# EAGLE design 8_digit_7_segment (EAGLE 9.2.0)

## Sheet 1 of 2
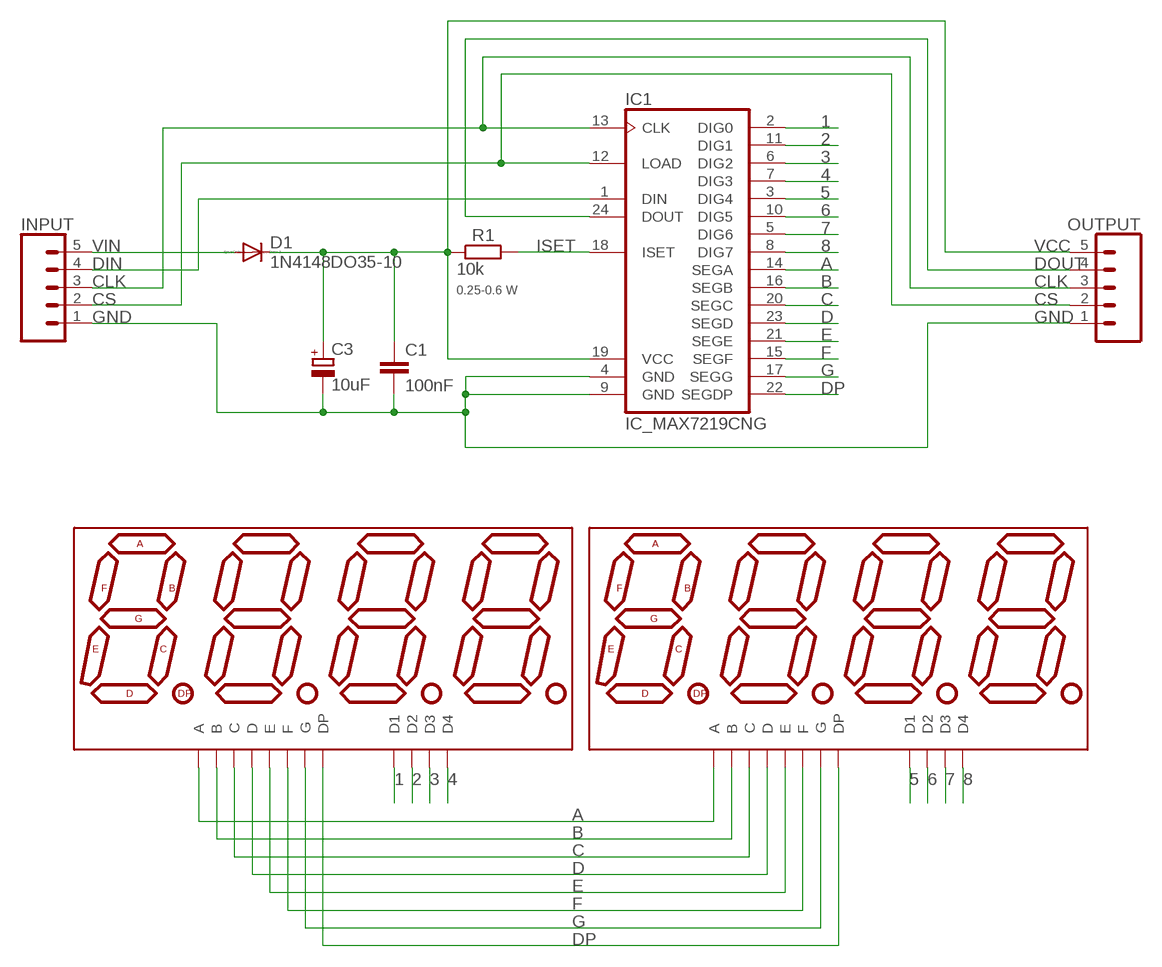
[diagram p0: schematic, sheet 1]

### Parts
C1  100nF  CAPACITOR_1025-024X044  [C025-024X044]
C3  10uF  CAPACITOR_POLARIZEDE2-5  [E2-5]
D1  1N4148DO35-10  DIODED-10  [D-10]
DISP5  ATA8041ARBJ  DISPLAY_7_SEGMENT_4DIGIT_20MM-RED  [7-SEGMENT-4DIGIT-20MM]
DISP6  ATA8041ARBJ  DISPLAY_7_SEGMENT_4DIGIT_20MM-RED  [7-SEGMENT-4DIGIT-20MM]
IC1  IC_MAX7219CNG  [DIL24-3]
INPUT  CONN_051X05LA  [1X05/90]
OUTPUT  CONN_051X05/90_FEMALE  [1X05/90FEMALE]
R1  10k  RESISTOR0207/7  [0207/7]

### Nets
1: DISP5.12(D1) IC1.2(DIG0)
2: DISP5.9(D2) IC1.11(DIG1)
3: DISP5.8(D3) IC1.6(DIG2)
4: DISP5.6(D4) IC1.7(DIG3)
5: DISP6.12(D1) IC1.3(DIG4)
6: DISP6.9(D2) IC1.10(DIG5)
7: DISP6.8(D3) IC1.5(DIG6)
8: DISP6.6(D4) IC1.8(DIG7)
A: DISP5.11(A) DISP6.11(A) IC1.14(SEGA)
B: DISP5.7(B) DISP6.7(B) IC1.16(SEGB)
C: DISP5.4(C) DISP6.4(C) IC1.20(SEGC)
CLK: IC1.13(CLK) INPUT.3 OUTPUT.3
CS: IC1.12(LOAD) INPUT.2 OUTPUT.2
D: DISP5.2(D) DISP6.2(D) IC1.23(SEGD)
DIN: IC1.1(DIN) INPUT.4
DOUT: IC1.24(DOUT) OUTPUT.4
DP: DISP5.3(DP) DISP6.3(DP) IC1.22(SEGDP)
E: DISP5.1(E) DISP6.1(E) IC1.21(SEGE)
F: DISP5.10(F) DISP6.10(F) IC1.15(SEGF)
G: DISP5.5(G) DISP6.5(G) IC1.17(SEGG)
GND: C1.2 C3.- IC1.4(GND) IC1.9(GND) INPUT.1 OUTPUT.1
ISET: IC1.18(ISET) R1.2
VCC: C1.1 C3.+ D1.C IC1.19(VCC) OUTPUT.5 R1.1
VIN: D1.A INPUT.5

## Sheet 2 of 2

## Library data of the parts
C1 = 006-rcl:CAPACITOR_1: CAPACITOR, European symbol; SPICEPREFIX: C
C3 = 006-rcl:CAPACITOR_POLARIZED: POLARIZED CAPACITOR, European symbol; SPICEPREFIX: C
D1 = 13-diode:DIODE: DIODE
DISP5 DISP6 = 001-private-inventory:DISPLAY_7_SEGMENT_4DIGIT_20MM: 4 Digit 7 Segment Display This is a part for the 4-Digit 7-segment LEDs from Young Sun. Different from the Digikey LEDs, all 16 pins are used. The LONGPADS Variant is used for a test jig, but you may like it because there is more pad to solder to. If you are concerned about routing space, the standard works just fine though. Datasheets: Red <http://cdn.sparkfun.com/datasheets/Components/LED/1LEDREDCC.pdf> Yellow <http://cdn.sparkfun.com/datasheets/Components/LED/1LEDYELCC.pdf> Green <http://cdn.sparkfun.com/datasheets/Components/LED/1LEDGRNCC.pdf> Blue <http://cdn.sparkfun.com/datasheets/Components/LED/1LEDBLUCC.pdf> White <http://cdn.sparkfun.com/datasheets/Components/LED/1LEDWHTCC.pdf> SparkFun Products Raw Components 7-Segment Display - 20mm (Red) <https://www.sparkfun.com/products/11405> (COM-11405) 7-Segment Display - 20mm (Yellow) <https://www.sparkfun.com/products/11406> (COM-11406) 7-Segment Display - 20mm (Green) <https://www.sparkfun.com/products/11407> (COM-11407) 7-Segment Display - 20mm (Blue) <https://www.sparkfun.com/products/11408> (COM-11408) 7-Segment Display - 20mm (White) <https://www.sparkfun.com/products/11409> (COM-11409) Serial Controlled SparkFun OpenSegment Serial Display - 20mm (Red) <https://www.sparkfun.com/products/11644> (COM-11644) SparkFun OpenSegment Serial Display - 20mm (Yellow) <https://www.sparkfun.com/products/11645> (COM-11645) SparkFun OpenSegment Serial Display - 20mm (Green) <https://www.sparkfun.com/products/11646> (COM-11646) SparkFun OpenSegment Serial Display - 20mm (Blue) <https://www.sparkfun.com/products/11647> (COM-11647) SparkFun OpenSegment Serial Display - 20mm (White) <https://www.sparkfun.com/products/11648> (COM-11648) Other SparkFun OpenSegment Shield <https://www.sparkfun.com/products/13190> (DEV-13190); PROD_ID: COMP-11449
IC1 = 14-displays:IC_MAX7219CNG: LED DISPLAY DRIVER; MF: MAXIM; MPN: MAX7219CNG; OC_FARNELL: 1523914; OC_NEWARK: 34C4018
INPUT = 001-private-inventory:CONN_05: Multi connection point. Often used as Generic Header-pin footprint for 0.1 inch spaced/style header connections On any of the 0.1 inch spaced packages, you can populate with these: Break Away Headers - Straight <https://www.sparkfun.com/products/116> (PRT-00116) Break Away Male Headers - Right Angle <https://www.sparkfun.com/products/553> (PRT-00553) Female Headers <https://www.sparkfun.com/products/115> (PRT-00115) Break Away Headers - Machine Pin <https://www.sparkfun.com/products/117> (PRT-00117) Break Away Female Headers - Swiss Machine Pin <https://www.sparkfun.com/products/743> (PRT-00743) For SCREWTERMINALS and SPRING TERMINALS visit here: Screw Terimnals on SparkFun.com <https://www.sparkfun.com/search/results?term=Screw+Terminals> (5mm/3.5mm/2.54mm spacing) This device is also useful as a general connection point to wire up your design to another part of your project. Our various solder wires solder well into these plated through hole pads. Hook-Up Wire - Assortment (Stranded, 22 AWG) <https://www.sparkfun.com/products/11375> (PRT-11375) Hook-Up Wire - Assortment (Solid Core, 22 AWG) <https://www.sparkfun.com/products/11367> (PRT-11367) View the entire wire category on our website here <https://www.sparkfun.com/categories/141> Special notes: Molex polarized connector foot print use with SKU : PRT-08231 with associated crimp pins and housings. 1MM SMD Version SKU: PRT-10208
OUTPUT = 007-connectors:CONN_05: Multi connection point. Often used as Generic Header-pin footprint for 0.1 inch spaced/style header connections On any of the 0.1 inch spaced packages, you can populate with these: Break Away Headers - Straight <https://www.sparkfun.com/products/116> (PRT-00116) Break Away Male Headers - Right Angle <https://www.sparkfun.com/products/553> (PRT-00553) Female Headers <https://www.sparkfun.com/products/115> (PRT-00115) Break Away Headers - Machine Pin <https://www.sparkfun.com/products/117> (PRT-00117) Break Away Female Headers - Swiss Machine Pin <https://www.sparkfun.com/products/743> (PRT-00743) For SCREWTERMINALS and SPRING TERMINALS visit here: Screw Terimnals on SparkFun.com <https://www.sparkfun.com/search/results?term=Screw+Terminals> (5mm/3.5mm/2.54mm spacing) This device is also useful as a general connection point to wire up your design to another part of your project. Our various solder wires solder well into these plated through hole pads. Hook-Up Wire - Assortment (Stranded, 22 AWG) <https://www.sparkfun.com/products/11375> (PRT-11375) Hook-Up Wire - Assortment (Solid Core, 22 AWG) <https://www.sparkfun.com/products/11367> (PRT-11367) View the entire wire category on our website here <https://www.sparkfun.com/categories/141> Special notes: Molex polarized connector foot print use with SKU : PRT-08231 with associated crimp pins and housings. 1MM SMD Version SKU: PRT-10208
R1 = 006-rcl:RESISTOR: RESISTOR, European symbol; POWER: 0.25-0.6 W; SPICEPREFIX: R

## Board
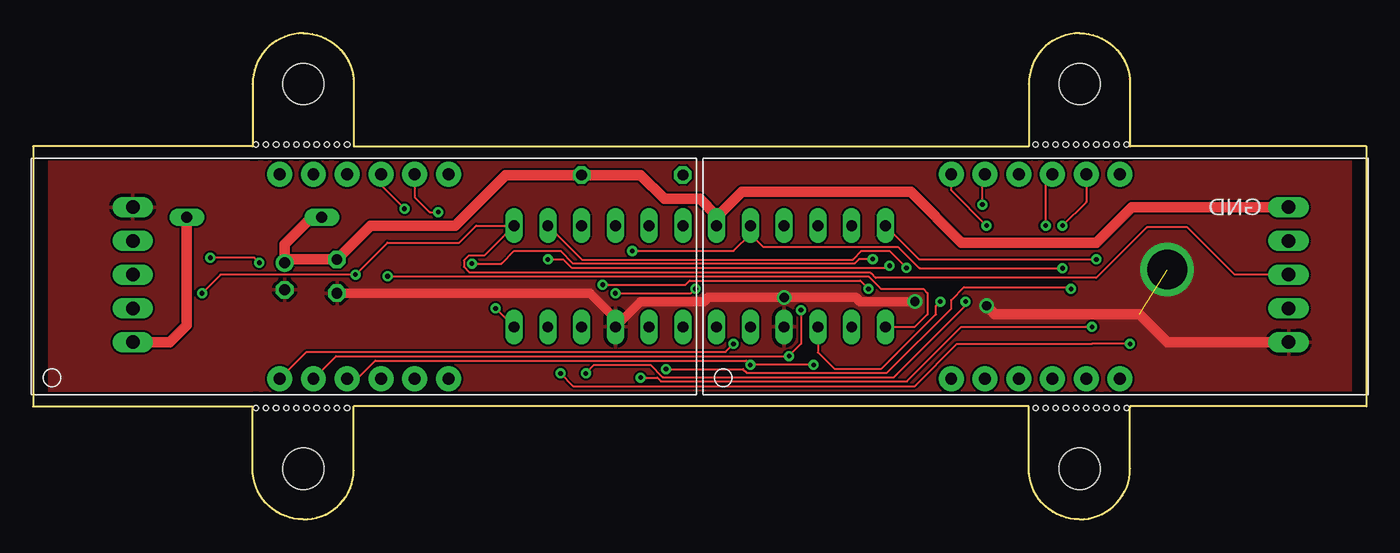
[diagram p1: board, top side]
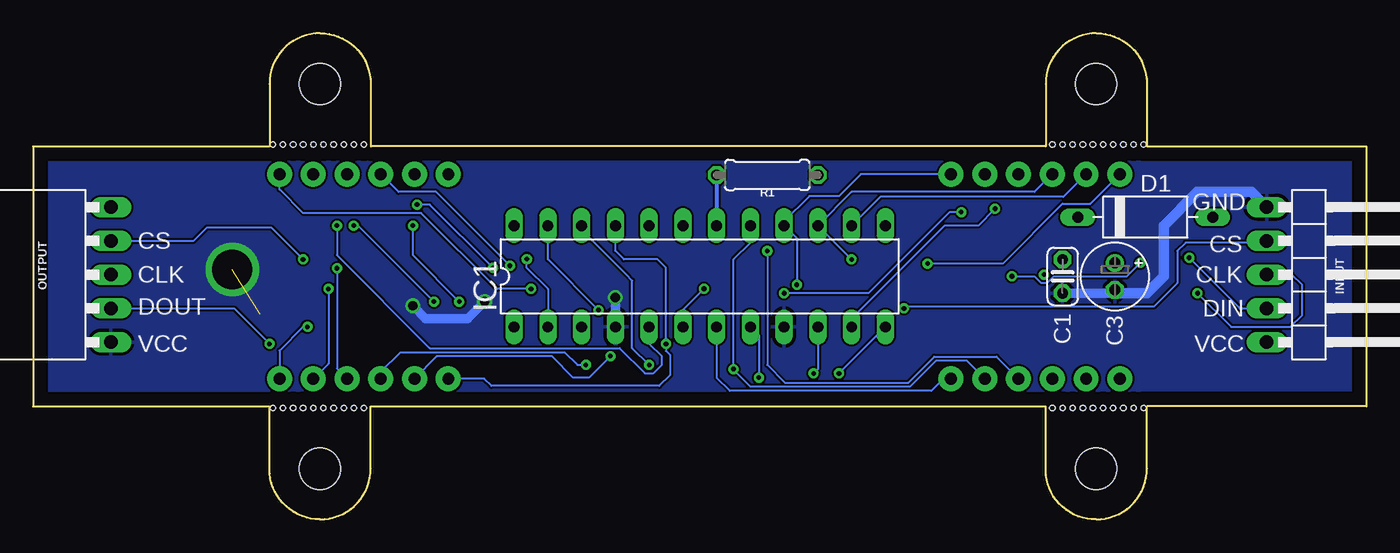
[diagram p2: board, bottom side, seen from below]

Size 100.33 x 36.58 mm. Coordinates in mm from the lower left corner, seen from the top.
Outline: 16.51,28.07 0,28.07 0,8.51 16.51,8.51 16.51,3.81 arc90 20.32,0 arc90 24.13,3.68 24.13,8.51 74.93,8.51 74.93,3.81 arc90 78.74,0 arc90 82.55,3.81 82.55,8.38 82.55,8.51 100.33,8.51 100.33,28.07 82.55,28.07 82.55,32.77 arc90 78.74,36.58 arc90 74.93,32.77 74.93,28.07 24.13,28.07 24.13,32.77 arc90 20.32,36.58 arc90 16.51,32.77 16.51,28.07
Copper layers (1*16): Top 0.035mm / dielectric 1.5mm / Bottom 0.035mm
Design rules "default": minimum track width 6mil, minimum drill 0.35mm, track to track 6mil, track to pad 6mil, pad to pad 6mil, via to via 6mil, smd to smd 6mil, copper to edge 40mil, drill to drill 6mil, minimum pad ring 10mil, minimum via ring 8mil, stop-mask expansion 4mil, vias tented up to drill 0mil, thermal gap 10mil
Holes 3.1 mm at 20.32,3.81 20.32,32.77 78.74,32.77 78.74,3.81
Holes 0.4 mm at 16.76,8.38 17.53,8.38 18.29,8.38 19.05,8.38 19.81,8.38 20.57,8.38 21.34,8.38 22.1,8.38 22.86,8.38 23.62,8.38 75.44,8.38 76.2,8.38 76.96,8.38 77.72,8.38 78.49,8.38 79.25,8.38 80.01,8.38 80.77,8.38 81.53,8.38 82.3,8.38 82.3,28.19 81.53,28.19 80.77,28.19 80.01,28.19 79.25,28.19 78.49,28.19 77.72,28.19 76.96,28.19 76.2,28.19 75.44,28.19 23.62,28.19 22.86,28.19 22.1,28.19 21.34,28.19 20.57,28.19 19.81,28.19 19.05,28.19 18.29,28.19 17.53,28.19 16.76,28.19

### Footprints (pad centres in the part's own frame; a part is rotated, then mirrored left to right if it is on the bottom)
C025-024X044 = drill 0.813 octagon: 1 -1.27,0; 2 1.27,0
E2-5 = drill 0.813 pad 1.27: + -1.016,0 | drill 0.813 pad 1.27 octagon: - 1.016,0
D-10 = drill 0.813 long: A 5.08,0; C -5.08,0
7-SEGMENT-4DIGIT-20MM = drill 0.9 pad 1.88: 1 -6.35,-3.886; 2 -3.81,-3.886; 3 -1.27,-3.886; 4 1.27,-3.886; 5 3.81,-3.886; 6 6.35,-3.886; 7 6.35,11.506; 8 3.81,11.506; 9 1.27,11.506; 10 -1.27,11.506; 11 -3.81,11.506; 12 -6.35,11.506
DIL24-3 = drill 0.813 long: 1 -13.97,-3.81; 2 -11.43,-3.81; 3 -8.89,-3.81; 4 -6.35,-3.81; 5 -3.81,-3.81; 6 -1.27,-3.81; 7 1.27,-3.81; 8 3.81,-3.81; 9 6.35,-3.81; 10 8.89,-3.81; 11 11.43,-3.81; 12 13.97,-3.81; 13 13.97,3.81; 14 11.43,3.81; 15 8.89,3.81; 16 6.35,3.81; 17 3.81,3.81; 18 1.27,3.81; 19 -1.27,3.81; 20 -3.81,3.81; 21 -6.35,3.81; 22 -8.89,3.81; 23 -11.43,3.81; 24 -13.97,3.81
1X05/90 = drill 1.016 long: 1 -5.08,-3.81; 2 -2.54,-3.81; 3 0,-3.81; 4 2.54,-3.81; 5 5.08,-3.81
1X05/90FEMALE = drill 1.016 long: 1 -5.08,-3.81; 2 -2.54,-3.81; 3 0,-3.81; 4 2.54,-3.81; 5 5.08,-3.81
0207/7 = drill 0.813 octagon: 1 -3.81,0; 2 3.81,0

### Placement (x,y rotation side)
C1  22.86,18.29 270 bottom
C3  18.92,18.29 270 bottom
D1  16.64,22.73 0 bottom
DISP5  24.9,14.47 0 top
DISP6  75.44,14.47 0 top
IC1  50.16,18.29 0 bottom
INPUT  3.68,18.42 270 bottom
OUTPUT  98.3,18.42 90 bottom
R1  45.09,25.91 180 bottom

### Tracks (layer width: path | path; a pad name or v marks a point on that pad's centre or on a via)
1  (via drill 0.35)
  Top 0.152: v33.02,19.24 35.24,19.24 36.2,20.19 39.69,20.19 40.64,19.24 61.8,19.24 62.15,19.59 v63.18,19.59
  Bottom 0.152: DISP5.12 20.77,23.75 22.86,23.75 27.37,19.24 v33.02,19.24 | IC1.2 61.59,17.34 63.18,18.92 v63.18,19.59
2  (via drill 0.35)
  Top 0.152: DISP5.9 26.17,25.14 v27.94,23.37
  Bottom 0.152: IC1.11 38.73,15.11 31.75,22.1 29.21,22.1 v27.94,23.37
3  (via drill 0.35)
  Top 0.152: DISP5.8 28.71,24.25 29.84,23.11 v30.48,23.11 | v49.85,17.35 49.52,17.02 v43.81,17.02
  Bottom 0.152: v43.81,17.02 37.47,17.02 31.37,23.11 v30.48,23.11 | IC1.6 51.44,15.76 v49.85,17.35
4
  Bottom 0.152: DISP5.6 31.84,10.58 32.74,9.68 47.9,9.68 48.89,10.67 IC1.7
5  (via drill 0.35)
  Top 0.152: IC1.3 59.05,12.57 60.31,11.32 63.83,11.32 67.94,15.43 67.94,16.07 v68.26,16.38 | v71.75,22.1 69.09,24.77 DISP6.12
  Bottom 0.152: v68.26,16.38 71.75,19.88 v71.75,22.1
6  (via drill 0.35)
  Top 0.152: v41.59,10.99 42.23,11.62 46.45,11.62 47.37,10.7 64.8,10.7 70.17,16.07 v70.17,16.38 | v76.2,22.1 76.2,25.47 DISP6.9
  Bottom 0.152: IC1.10 41.28,11.3 v41.59,10.99 | v70.17,16.38 75.88,22.1 v76.2,22.1
7  (via drill 0.35)
  Top 0.152: DISP6.8 79.25,23.88 v77.47,22.1
  Bottom 0.152: IC1.5 53.98,13.21 53.02,12.26 53.02,11.62 53.66,10.99 54.29,10.99 56.2,12.89 70.48,12.89 77.47,19.88 v77.47,22.1
8  (via drill 0.35)
  Top 0.152: v45.72,10.67 46.97,10.67 47.25,10.39 65.76,10.39 69.85,14.48 v79.69,14.48
  Bottom 0.152: IC1.8 45.72,13.84 v45.72,10.67 | v79.69,14.48 80.01,14.48 81.79,12.7 DISP6.6
A  (via drill 0.35)
  Top 0.152: IC1.14 41.29,19.54 61.68,19.54 62.32,20.19 64.45,20.19 v65.72,18.92 | v71.44,23.69 71.44,25.78 DISP6.11
  Bottom 0.152: DISP5.11 22.8,24.26 36.58,24.26 IC1.14 | v65.72,18.92 70.48,23.69 v71.44,23.69
B  (via drill 0.35)
  Top 0.152: v42.86,17.65 49.1,17.65 49.4,17.96 62.24,17.96 v62.87,17.34
  Bottom 0.152: DISP5.7 38.03,25.97 39.69,24.32 41.91,24.32 43.81,22.42 IC1.16 42.86,21.15 v42.86,17.65 | v62.87,17.34 65.41,17.34 71.12,23.05 80.01,23.05 81.79,24.83 DISP6.7
C  (via drill 0.35)
  Top 0.152: v45.09,20.19 52.7,20.19 53.98,21.46 | 53.98,21.46 IC1.20 | v77.47,18.89 66.7,18.89 65.09,20.51 54.93,20.51 53.98,21.46
  Bottom 0.152: DISP5.4 27.83,12.24 32.51,12.24 34.47,10.29 43.75,10.29 45.09,11.62 v45.09,20.19 | v77.47,18.89 77.47,11.34 DISP6.4
CLK  (via drill 0.35)
  Top 0.152: v12.7,17.02 14.1,18.42 v24.26,18.42 26.67,20.83 32.07,20.83 33.34,22.1 IC1.13 33.94,19.85 32.77,19.85 32.41,19.49 32.41,18.99 32.81,18.59 62.99,18.59 63.08,18.5 63.4,18.19 63.42,18.16 80.01,18.16 83.82,21.97 86.87,21.97 90.42,18.42 OUTPUT.3
  Bottom 0.152: v12.7,17.02 10.16,14.48 5.72,14.48 4.83,15.37 4.83,17.65 5.59,18.42 INPUT.3
CS  (via drill 0.35)
  Top 0.152: v34.8,15.88 IC1.12 | v39.69,10.99 40.64,10.03 66.36,10.03 69.53,13.21 79.69,13.21 v82.55,13.21
  Bottom 0.152: IC1.12 v39.69,10.99 | INPUT.2 7.62,20.83 13.59,20.83 14.22,20.19 14.22,17.78 16,16 34.67,16 v34.8,15.88 | OUTPUT.2 85.22,15.88 v82.55,13.21
D  (via drill 0.35)
  Top 0.152: v57.79,15.75 57.79,13.2 56.9,12.31 v56.9,12.28 22.79,12.28 DISP5.2
  Bottom 0.152: v57.79,15.75 61.59,19.56 IC1.23 | DISP6.2 69.95,12.26 61.28,12.26 59.69,10.67 58.51,10.67 v56.9,12.28
DIN  (via drill 0.35)
  Top 0.152: v26.67,18.29 62.87,18.29 63.82,17.34 66.99,17.34 67.31,17.02 67.31,15.43 66.68,14.8 66.36,14.48 IC1.1 | v17.02,19.3 16.64,19.68 v13.34,19.68
  Bottom 0.152: v26.67,18.29 24.99,18.29 24.51,17.81 24.01,17.81 23.53,18.29 18.03,18.29 v17.02,19.3 | v13.34,19.68 9.53,15.88 INPUT.4
DOUT  (via drill 0.35)
  Top 0.152: IC1.24 66.68,19.56 v80.01,19.56
  Bottom 0.152: OUTPUT.4 88.27,20.96 87.25,21.97 82.42,21.97 v80.01,19.56
DP  (via drill 0.35)
  Top 0.152: DISP5.3 24.39,10.58 25.75,11.94 53.66,11.94 v53.98,11.62 v58.74,11.62
  Bottom 0.152: v53.98,11.62 55.25,12.89 55.25,17.97 55.72,18.45 59.05,21.78 IC1.22 | v58.74,11.62 59.37,11.62 60.33,12.57 72.69,12.57 74.17,11.09 DISP6.3
E  (via drill 0.35)
  Top 0.152: DISP5.1 20.58,12.61 48.95,12.61 52.11,12.61 v52.7,13.21
  Bottom 0.152: IC1.21 56.52,20.19 55.88,19.56 53.34,19.56 52.7,18.92 v52.7,13.21 52.7,12.69 52.4,12.38 52.4,10.86 53.21,10.05 65.85,10.05 66.38,10.58 DISP6.1
F  (via drill 0.35)
  Top 0.152: v38.73,19.56 39.89,19.56 40.51,18.94 64.3,18.94 v64.45,19.09
  Bottom 0.152: DISP5.10 24.96,24.64 38.73,24.64 IC1.15 v38.73,19.56 | v64.45,19.09 70,24.64 72.83,24.64 DISP6.10
G  (via drill 0.35)
  Top 0.152: v47.62,11.3 53.43,11.3 53.72,11.01 64.25,11.01 69.1,15.86 69.1,16.5 70.06,17.46 77.97,17.46 v78.11,17.34
  Bottom 0.152: IC1.17 46.36,20.83 47.62,19.56 v47.62,11.3 47.62,11.25 46.36,9.98 34.34,9.98 32.39,11.94 30.06,11.94 DISP5.5 | v78.11,17.34 78.11,11.73 DISP6.5
GND  (via drill 0.7, 3)  (1 unrouted)
  Top 0.728: C1.2 41.91,17.02 43.81,15.11 IC1.9 45.72,16.38 50.48,16.38 50.8,16.7 v56.52,16.7 61.91,16.7 62.23,16.38 v66.36,16.38
  Top 0.782: OUTPUT.1 85.34,13.34 83.25,15.43 72.39,15.43 v71.75,16.07
  Bottom 0.728: C3.- 19.18,17.02 C1.2 | v56.52,16.7 IC1.4 | v66.36,16.38 67.63,15.11 70.8,15.11 v71.75,16.07
  Bottom 0.782: INPUT.1 8.64,24.64 12.7,24.64 15.24,22.1 15.24,18.29 16.51,17.02 18.67,17.02 C3.-
  other vias: 85.34,18.8
  pour Bottom: 100.33,28.07 0,28.07 0,8.51 74.93,8.51 100.33,8.51 100.33,9.78
  pour Top: 0,28.07 100.33,28.07 100.33,8.51 0,8.51
ISET
  Bottom 0.305: R1.2 IC1.18
VCC
  Top 0.782: OUTPUT.5 82.68,23.5 80.01,20.83 69.85,20.83 66.04,24.64 53.34,24.64 51.44,22.73 IC1.19 51.44,22.86 50.16,24.13 47.5,24.13 45.72,25.91 R1.1 35.56,25.91 31.75,22.1 25.4,22.1 C1.1 19.18,19.56 C3.+ 18.92,20.7 20.96,22.73 D1.C
VIN
  Top 0.782: INPUT.5 10.29,13.34 11.56,14.61 D1.A

### Text on the board
tPlace: GND
bPlace: GND | CS | CS | CLK | CLK | DIN | DOUT | VCC | VCC